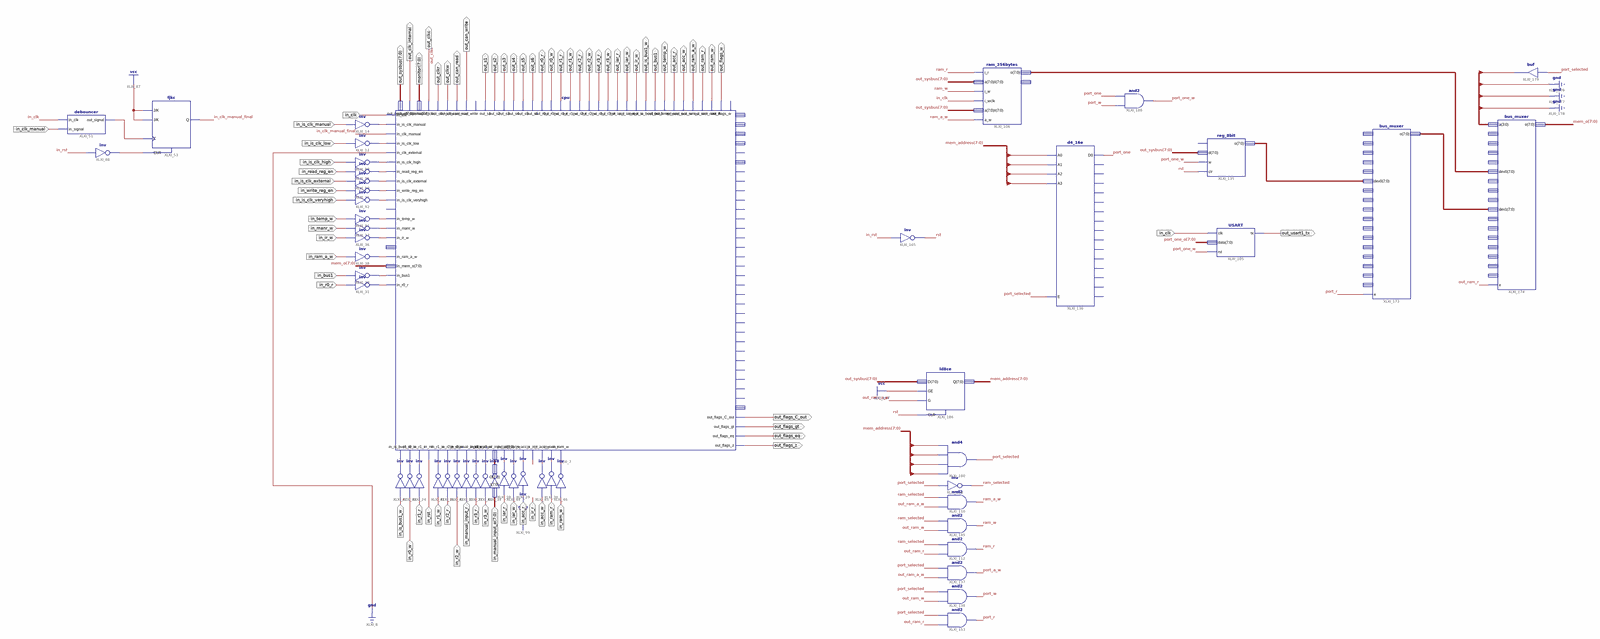
[diagram p0: schematic sheet 1, whole]
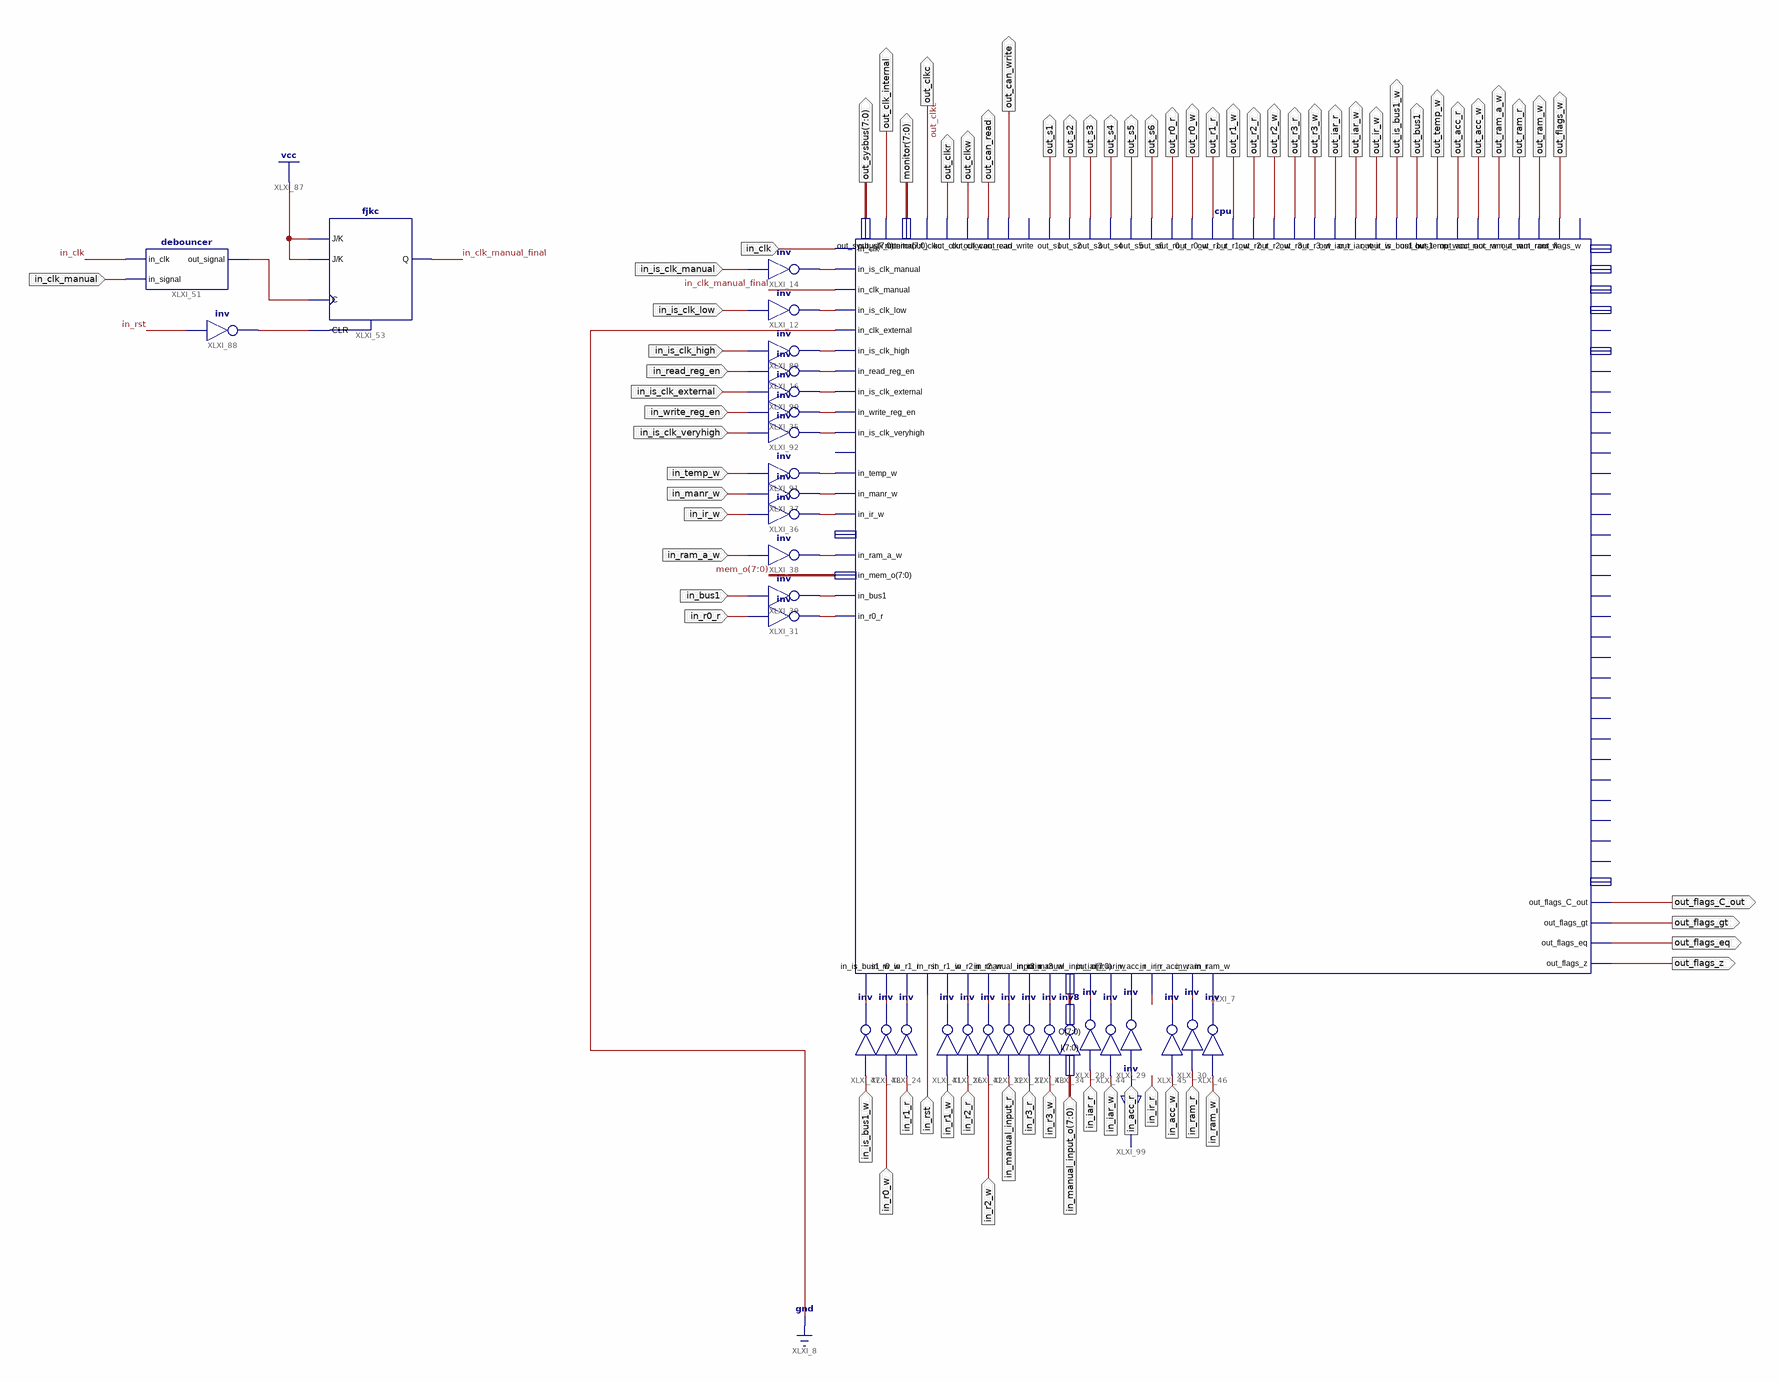
[diagram p1: schematic sheet 1, left part]
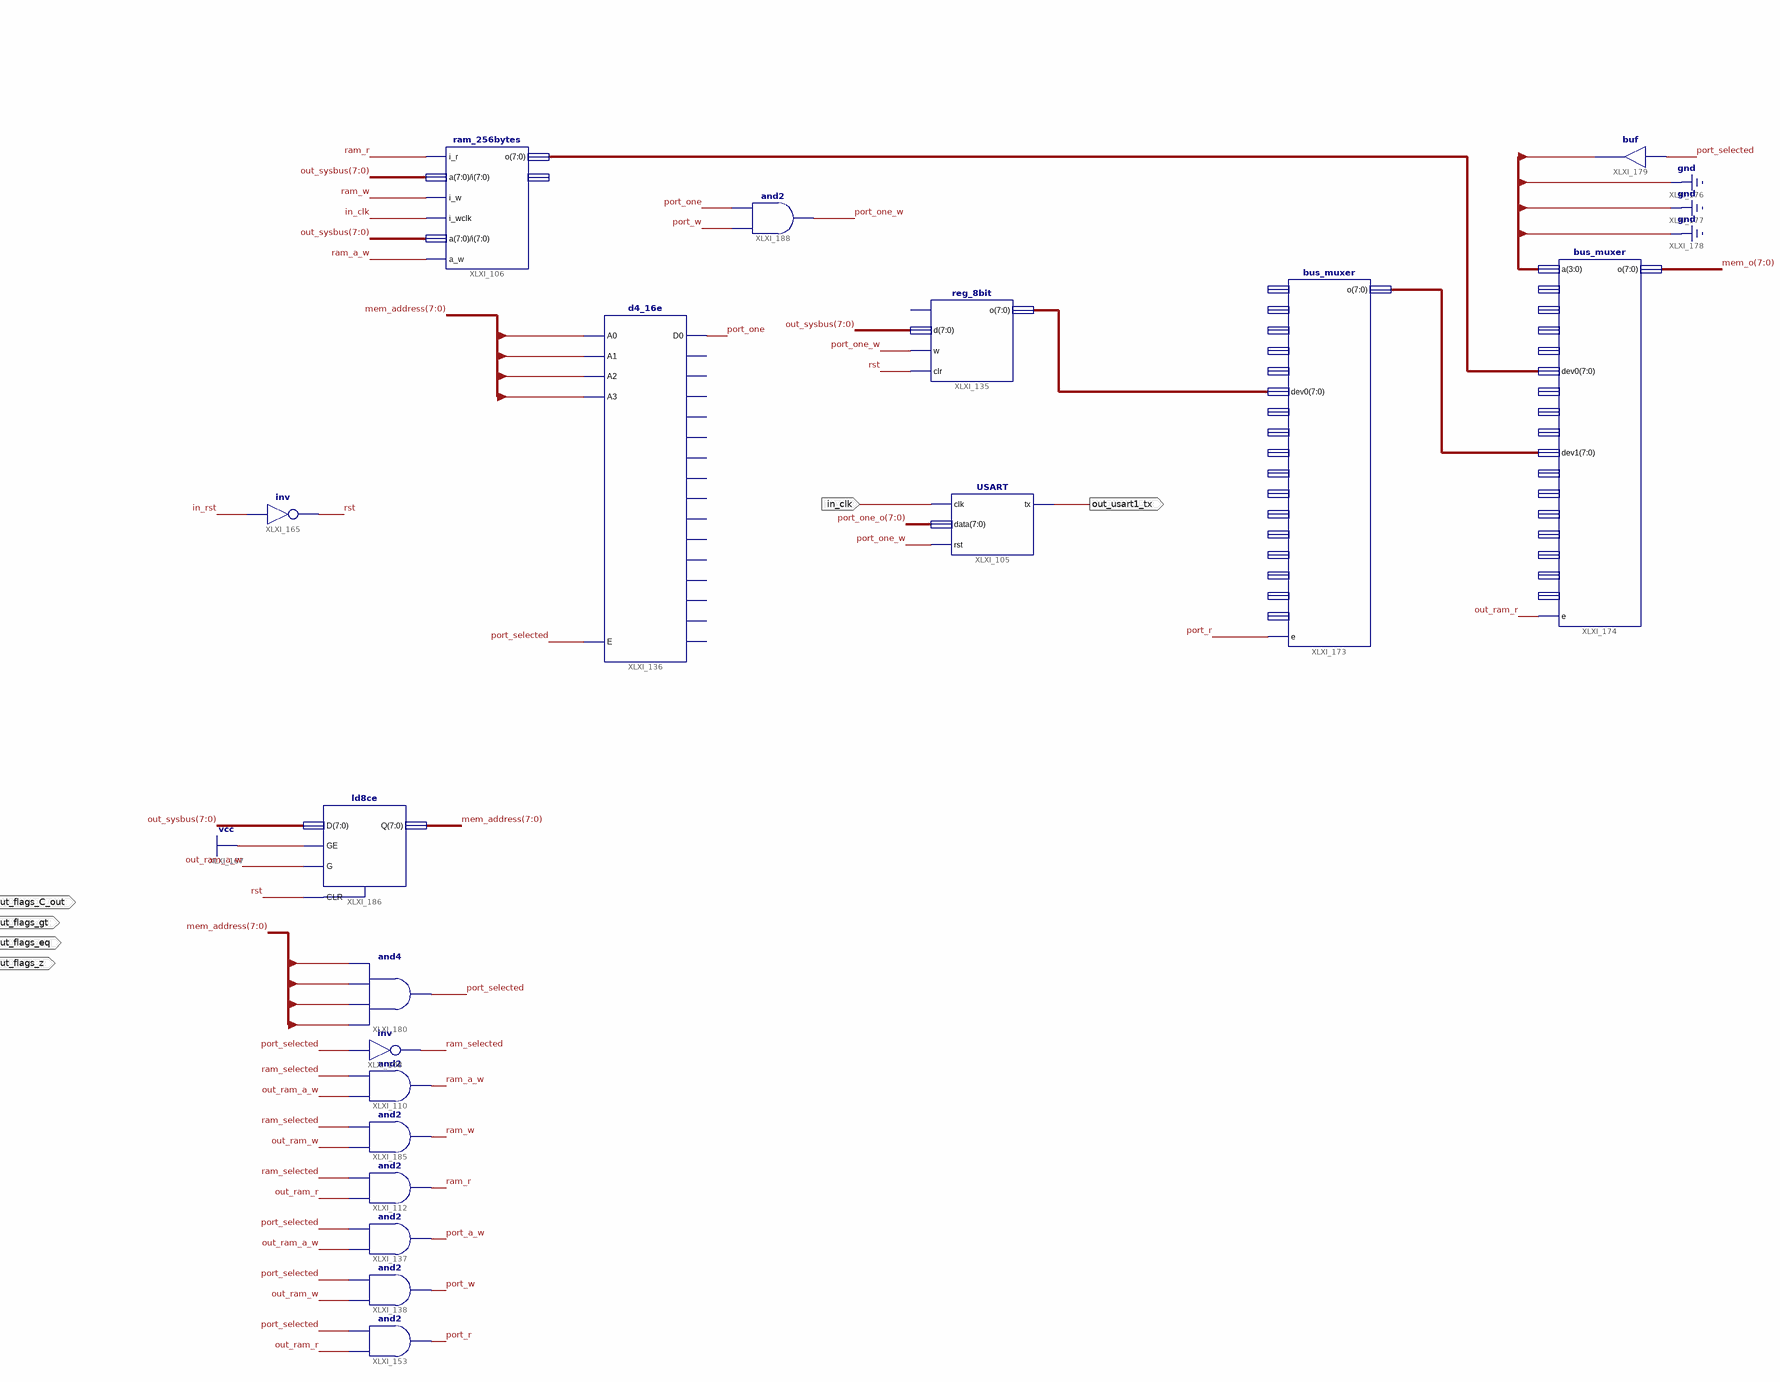
[diagram p2: schematic sheet 1, right part]
// Xilinx ISE schematic cpu_facade.sch (spartan3e) as structural Verilog: 52 symbols, 72 ports
module cpu_facade (
  input  in_clk,
  input  in_is_clk_low,
  input  in_is_clk_manual,
  input  in_read_reg_en,
  input  in_r1_r,
  input  in_rst,
  input  in_r2_r,
  input  in_r3_r,
  input  in_acc_r,
  input  in_iar_r,
  input  in_manual_input_r,
  input  [7:0] in_manual_input_o,
  input  in_r1_w,
  input  in_r2_w,
  input  in_r3_w,
  input  in_write_reg_en,
  input  in_is_bus1_w,
  input  in_r0_w,
  input  in_iar_w,
  input  in_clk_manual,
  input  in_is_clk_high,
  input  in_is_clk_external,
  input  in_is_clk_veryhigh,
  input  in_ir_w,
  input  in_manr_w,
  input  in_temp_w,
  input  in_ram_a_w,
  input  in_ram_w,
  input  in_ram_r,
  input  in_acc_w,
  input  in_ir_r,
  input  in_r0_r,
  input  in_bus1,
  output out_clk_internal,
  output out_s1,
  output out_s2,
  output out_s3,
  output out_s4,
  output [7:0] monitor,
  output out_clkc,
  output out_clkr,
  output out_clkw,
  output out_r0_w,
  output out_s6,
  output out_s5,
  output out_flags_C_out,
  output out_flags_gt,
  output out_flags_eq,
  output out_flags_z,
  output [7:0] out_sysbus,
  output out_can_read,
  output out_r0_r,
  output out_r1_r,
  output out_r2_r,
  output out_r3_r,
  output out_iar_r,
  output out_acc_r,
  output out_ram_r,
  output out_bus1,
  output out_r1_w,
  output out_r2_w,
  output out_r3_w,
  output out_iar_w,
  output out_ir_w,
  output out_temp_w,
  output out_acc_w,
  output out_ram_a_w,
  output out_ram_w,
  output out_flags_w,
  output out_can_write,
  output out_is_bus1_w,
  output out_usart1_tx
);

  wire in_clk_manual_debounced, in_clk_manual_final, port_a_w, port_one, port_one_w, port_r, port_selected,
       port_w, ram_a_w, ram_r, ram_selected, ram_w, rst, XLXN_52, XLXN_55, XLXN_60, XLXN_61, XLXN_62,
       XLXN_64, XLXN_65, XLXN_66, XLXN_67, XLXN_68, XLXN_70, XLXN_74, XLXN_76, XLXN_77, XLXN_78, XLXN_79,
       XLXN_80, XLXN_81, XLXN_82, XLXN_83, XLXN_84, XLXN_85, XLXN_98, XLXN_209, XLXN_210, XLXN_212, XLXN_213,
       XLXN_214, XLXN_216, XLXN_232;
  wire [0:0] mem_select;
  wire [7:0] mem_address, mem_o, port_one_o, XLXN_73, XLXN_431, XLXN_432;

  cpu XLXI_7 (
    .in_acc_r(XLXN_66), .in_acc_w(XLXN_84), .in_bus1(XLXN_78), .in_clk(in_clk), .in_clk_external(1'b0),
    .in_clk_manual(in_clk_manual_final), .in_iar_r(XLXN_65), .in_iar_w(XLXN_83), .in_ir_r(XLXN_232),
    .in_ir_w(XLXN_216), .in_is_bus1_w(XLXN_98), .in_is_clk_external(XLXN_212), .in_is_clk_high(XLXN_210),
    .in_is_clk_low(XLXN_52), .in_is_clk_manual(XLXN_55), .in_is_clk_veryhigh(XLXN_214), .in_manr_w(XLXN_76),
    .in_manual_input_o(XLXN_73), .in_manual_input_r(XLXN_70), .in_mem_o(mem_o), .in_r0_r(XLXN_68),
    .in_r0_w(XLXN_79), .in_r1_r(XLXN_61), .in_r1_w(XLXN_80), .in_r2_r(XLXN_62), .in_r2_w(XLXN_81),
    .in_r3_r(XLXN_64), .in_r3_w(XLXN_82), .in_ram_a_w(XLXN_77), .in_ram_r(XLXN_67), .in_ram_w(XLXN_85),
    .in_read_reg_en(XLXN_60), .in_rst(in_rst), .in_temp_w(XLXN_213), .in_write_reg_en(XLXN_74),
    .monitor(monitor), .out_acc_r(out_acc_r), .out_acc_w(out_acc_w), .out_bus1(out_bus1),
    .out_can_read(out_can_read), .out_can_write(out_can_write), .out_clkc(out_clkc), .out_clkr(out_clkr),
    .out_clkw(out_clkw), .out_clk_internal(out_clk_internal), .out_flags_C_out(out_flags_C_out),
    .out_flags_eq(out_flags_eq), .out_flags_gt(out_flags_gt), .out_flags_w(out_flags_w),
    .out_flags_z(out_flags_z), .out_iar_r(out_iar_r), .out_iar_w(out_iar_w), .out_ir_w(out_ir_w),
    .out_is_bus1_w(out_is_bus1_w), .out_r0_r(out_r0_r), .out_r0_w(out_r0_w), .out_r1_r(out_r1_r),
    .out_r1_w(out_r1_w), .out_r2_r(out_r2_r), .out_r2_w(out_r2_w), .out_r3_r(out_r3_r), .out_r3_w(out_r3_w),
    .out_ram_a_w(out_ram_a_w), .out_ram_r(out_ram_r), .out_ram_w(out_ram_w), .out_s1(out_s1),
    .out_s2(out_s2), .out_s3(out_s3), .out_s4(out_s4), .out_s5(out_s5), .out_s6(out_s6),
    .out_sysbus(out_sysbus), .out_temp_w(out_temp_w));  // open: in_manr_d, in_manr_r, manr_o, manr_r, manr_w, out_alu_C_in, out_alu_C_out, out_alu_eq, out_alu_gt, out_alu_x, out_alu_z, out_C_in_enabled, out_C_out_flipflop_o, out_flags_clr, out_iar_o, out_ir_o, out_op_alt_nop, out_op_alu, out_op_alu_add, out_op_alu_and, out_op_alu_lshift, out_op_alu_nop, out_op_alu_not, out_op_alu_or, out_op_alu_rshift, out_op_alu_xor, out_op_flg_clf, out_op_jmp_ifjmp, out_op_jmp_jmp, out_op_jmp_jmpr, out_op_ls_ld, out_op_ls_ldc, out_op_ls_st, out_ram_a_o, out_sysbus_released, out_temp_o
  not XLXI_12 (XLXN_52, in_is_clk_low);
  not XLXI_14 (XLXN_55, in_is_clk_manual);
  not XLXI_16 (XLXN_60, in_read_reg_en);
  not XLXI_24 (XLXN_61, in_r1_r);
  not XLXI_26 (XLXN_62, in_r2_r);
  not XLXI_27 (XLXN_64, in_r3_r);
  not XLXI_28 (XLXN_65, in_iar_r);
  not XLXI_29 (XLXN_66, in_acc_r);
  not XLXI_32 (XLXN_70, in_manual_input_r);
  inv8 XLXI_34 (.I(in_manual_input_o), .O(XLXN_73));
  not XLXI_35 (XLXN_74, in_write_reg_en);
  not XLXI_36 (XLXN_216, in_ir_w);
  not XLXI_37 (XLXN_76, in_manr_w);
  not XLXI_41 (XLXN_80, in_r1_w);
  not XLXI_42 (XLXN_81, in_r2_w);
  not XLXI_43 (XLXN_82, in_r3_w);
  not XLXI_44 (XLXN_83, in_iar_w);
  not XLXI_47 (XLXN_98, in_is_bus1_w);
  not XLXI_48 (XLXN_79, in_r0_w);
  debouncer XLXI_51 (.in_clk(in_clk), .in_signal(in_clk_manual), .out_signal(in_clk_manual_debounced));
  fjkc XLXI_53 (.C(in_clk_manual_debounced), .CLR(XLXN_209), .J(1'b1), .K(1'b1), .Q(in_clk_manual_final));
  not XLXI_88 (XLXN_209, in_rst);
  not XLXI_89 (XLXN_210, in_is_clk_high);
  not XLXI_90 (XLXN_212, in_is_clk_external);
  not XLXI_91 (XLXN_213, in_temp_w);
  not XLXI_92 (XLXN_214, in_is_clk_veryhigh);
  not XLXI_38 (XLXN_77, in_ram_a_w);
  not XLXI_46 (XLXN_85, in_ram_w);
  not XLXI_30 (XLXN_67, in_ram_r);
  not XLXI_45 (XLXN_84, in_acc_w);
  not XLXI_99 (XLXN_232, in_ir_r);
  d4_16e XLXI_136 (
    .A0(mem_address[0]), .A1(mem_address[1]), .A2(mem_address[2]), .A3(mem_address[3]), .E(port_selected),
    .D0(port_one));  // open: D1, D10, D11, D12, D13, D14, D15, D2, D3, D4, D5, D6, D7, D8, D9
  reg_8bit XLXI_135 (.clr(rst), .d(out_sysbus), .o(port_one_o), .w(port_one_w));  // open: r
  not XLXI_165 (rst, in_rst);
  bus_muxer XLXI_173 (
    .dev0(port_one_o), .e(port_r), .o(XLXN_432));  // open: a, dev1, dev10, dev11, dev12, dev13, dev14, dev15, dev2, dev3, dev4, dev5, dev6, dev7, dev8, dev9
  bus_muxer XLXI_174 (
    .a({3'b000, mem_select[0]}), .dev0(XLXN_431), .dev1(XLXN_432), .e(out_ram_r), .o(mem_o));  // open: dev10, dev11, dev12, dev13, dev14, dev15, dev2, dev3, dev4, dev5, dev6, dev7, dev8, dev9
  buf XLXI_179 (mem_select[0], port_selected);
  ram_256bytes XLXI_106 (
    .a(out_sysbus), .a_w(ram_a_w), .i(out_sysbus), .i_r(ram_r), .i_w(ram_w), .i_wclk(in_clk), .o(XLXN_431));  // open: a_o
  not XLXI_31 (XLXN_68, in_r0_r);
  not XLXI_39 (XLXN_78, in_bus1);
  and XLXI_110 (ram_a_w, out_ram_a_w, ram_selected);
  and XLXI_112 (ram_r, out_ram_r, ram_selected);
  not XLXI_108 (ram_selected, port_selected);
  and XLXI_137 (port_a_w, out_ram_a_w, port_selected);
  and XLXI_138 (port_w, out_ram_w, port_selected);
  and XLXI_153 (port_r, out_ram_r, port_selected);
  and XLXI_180 (port_selected, mem_address[4], mem_address[5], mem_address[6], mem_address[7]);
  and XLXI_185 (ram_w, out_ram_w, ram_selected);
  ld8ce XLXI_186 (.CLR(rst), .D(out_sysbus), .G(out_ram_a_w), .GE(1'b1), .Q(mem_address));
  USART XLXI_105 (.clk(in_clk), .data(port_one_o), .rst(port_one_w), .tx(out_usart1_tx));
  and XLXI_188 (port_one_w, port_w, port_one);
endmodule
